# EAGLE design board1 (EAGLE 8.3.2)
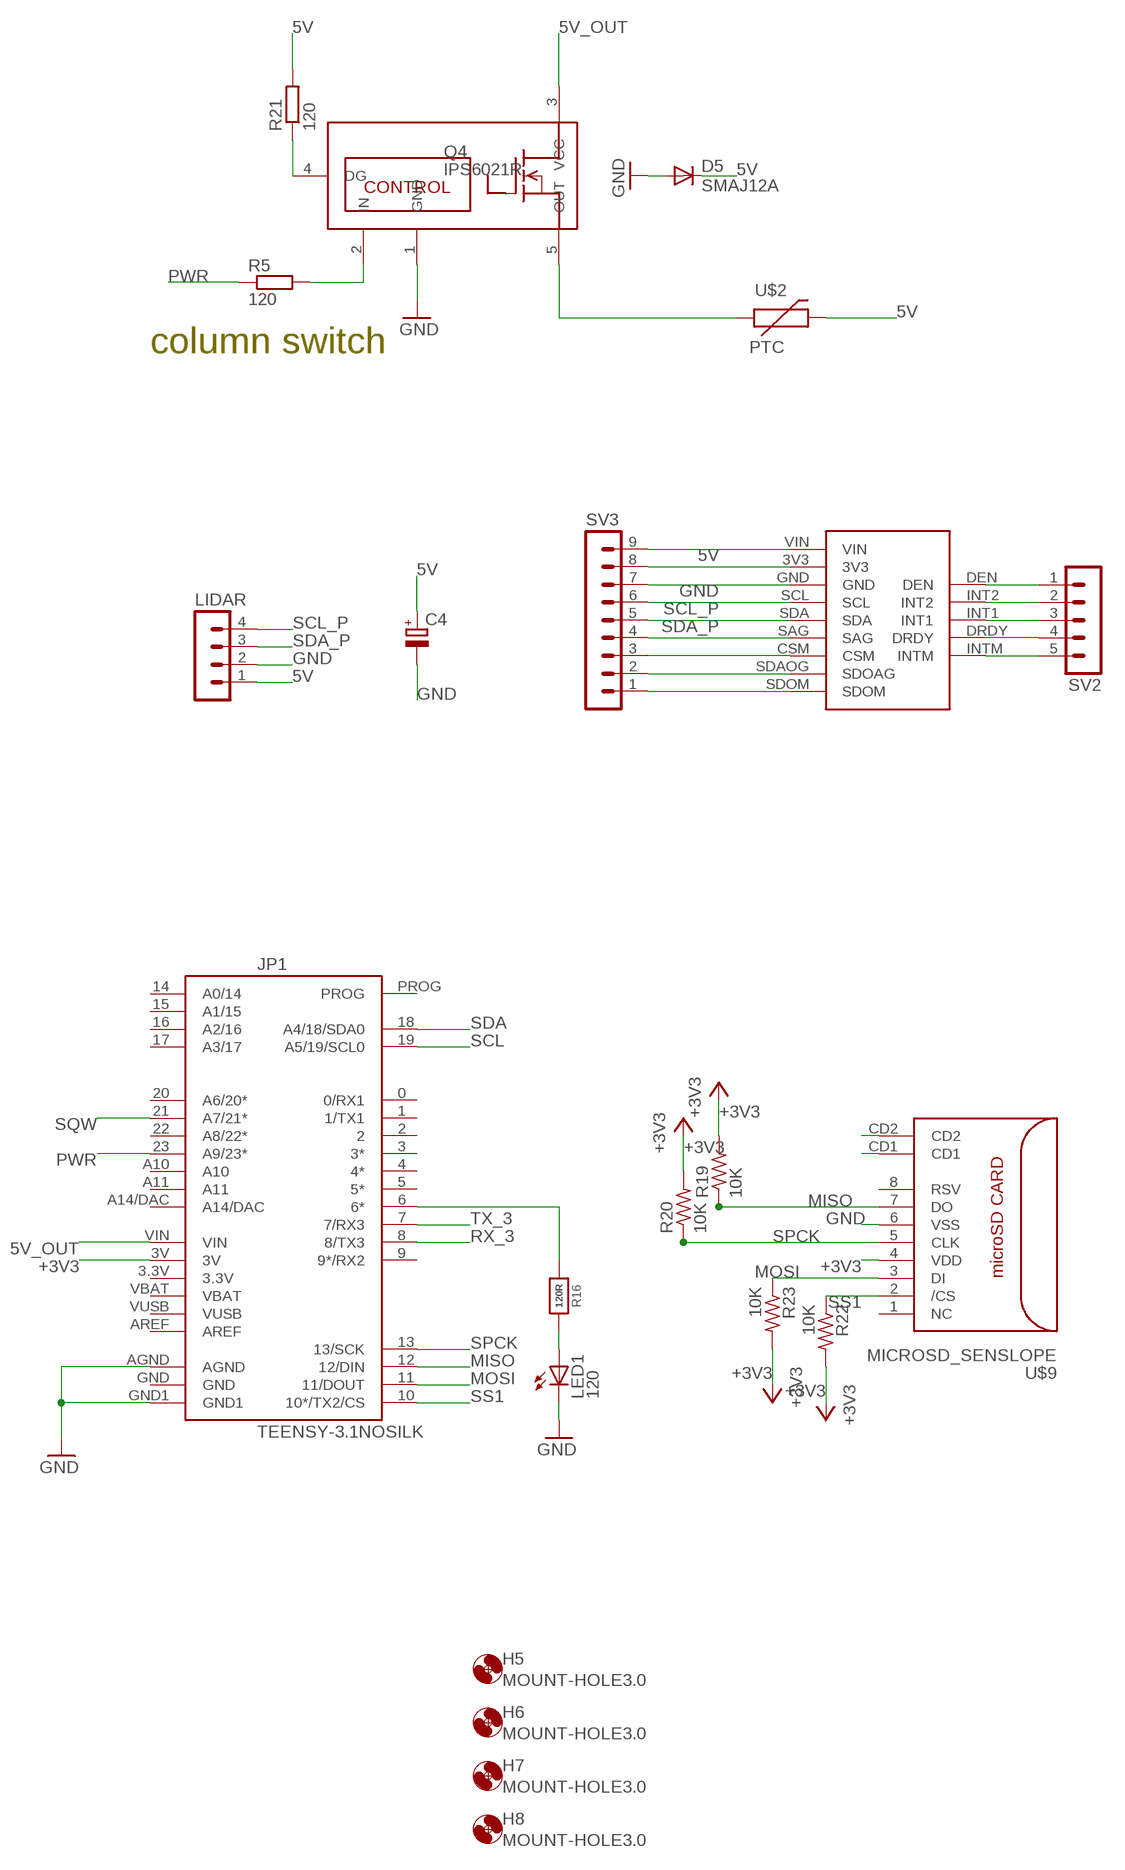
[diagram p0: schematic, sheet 1, part 1 of 2]
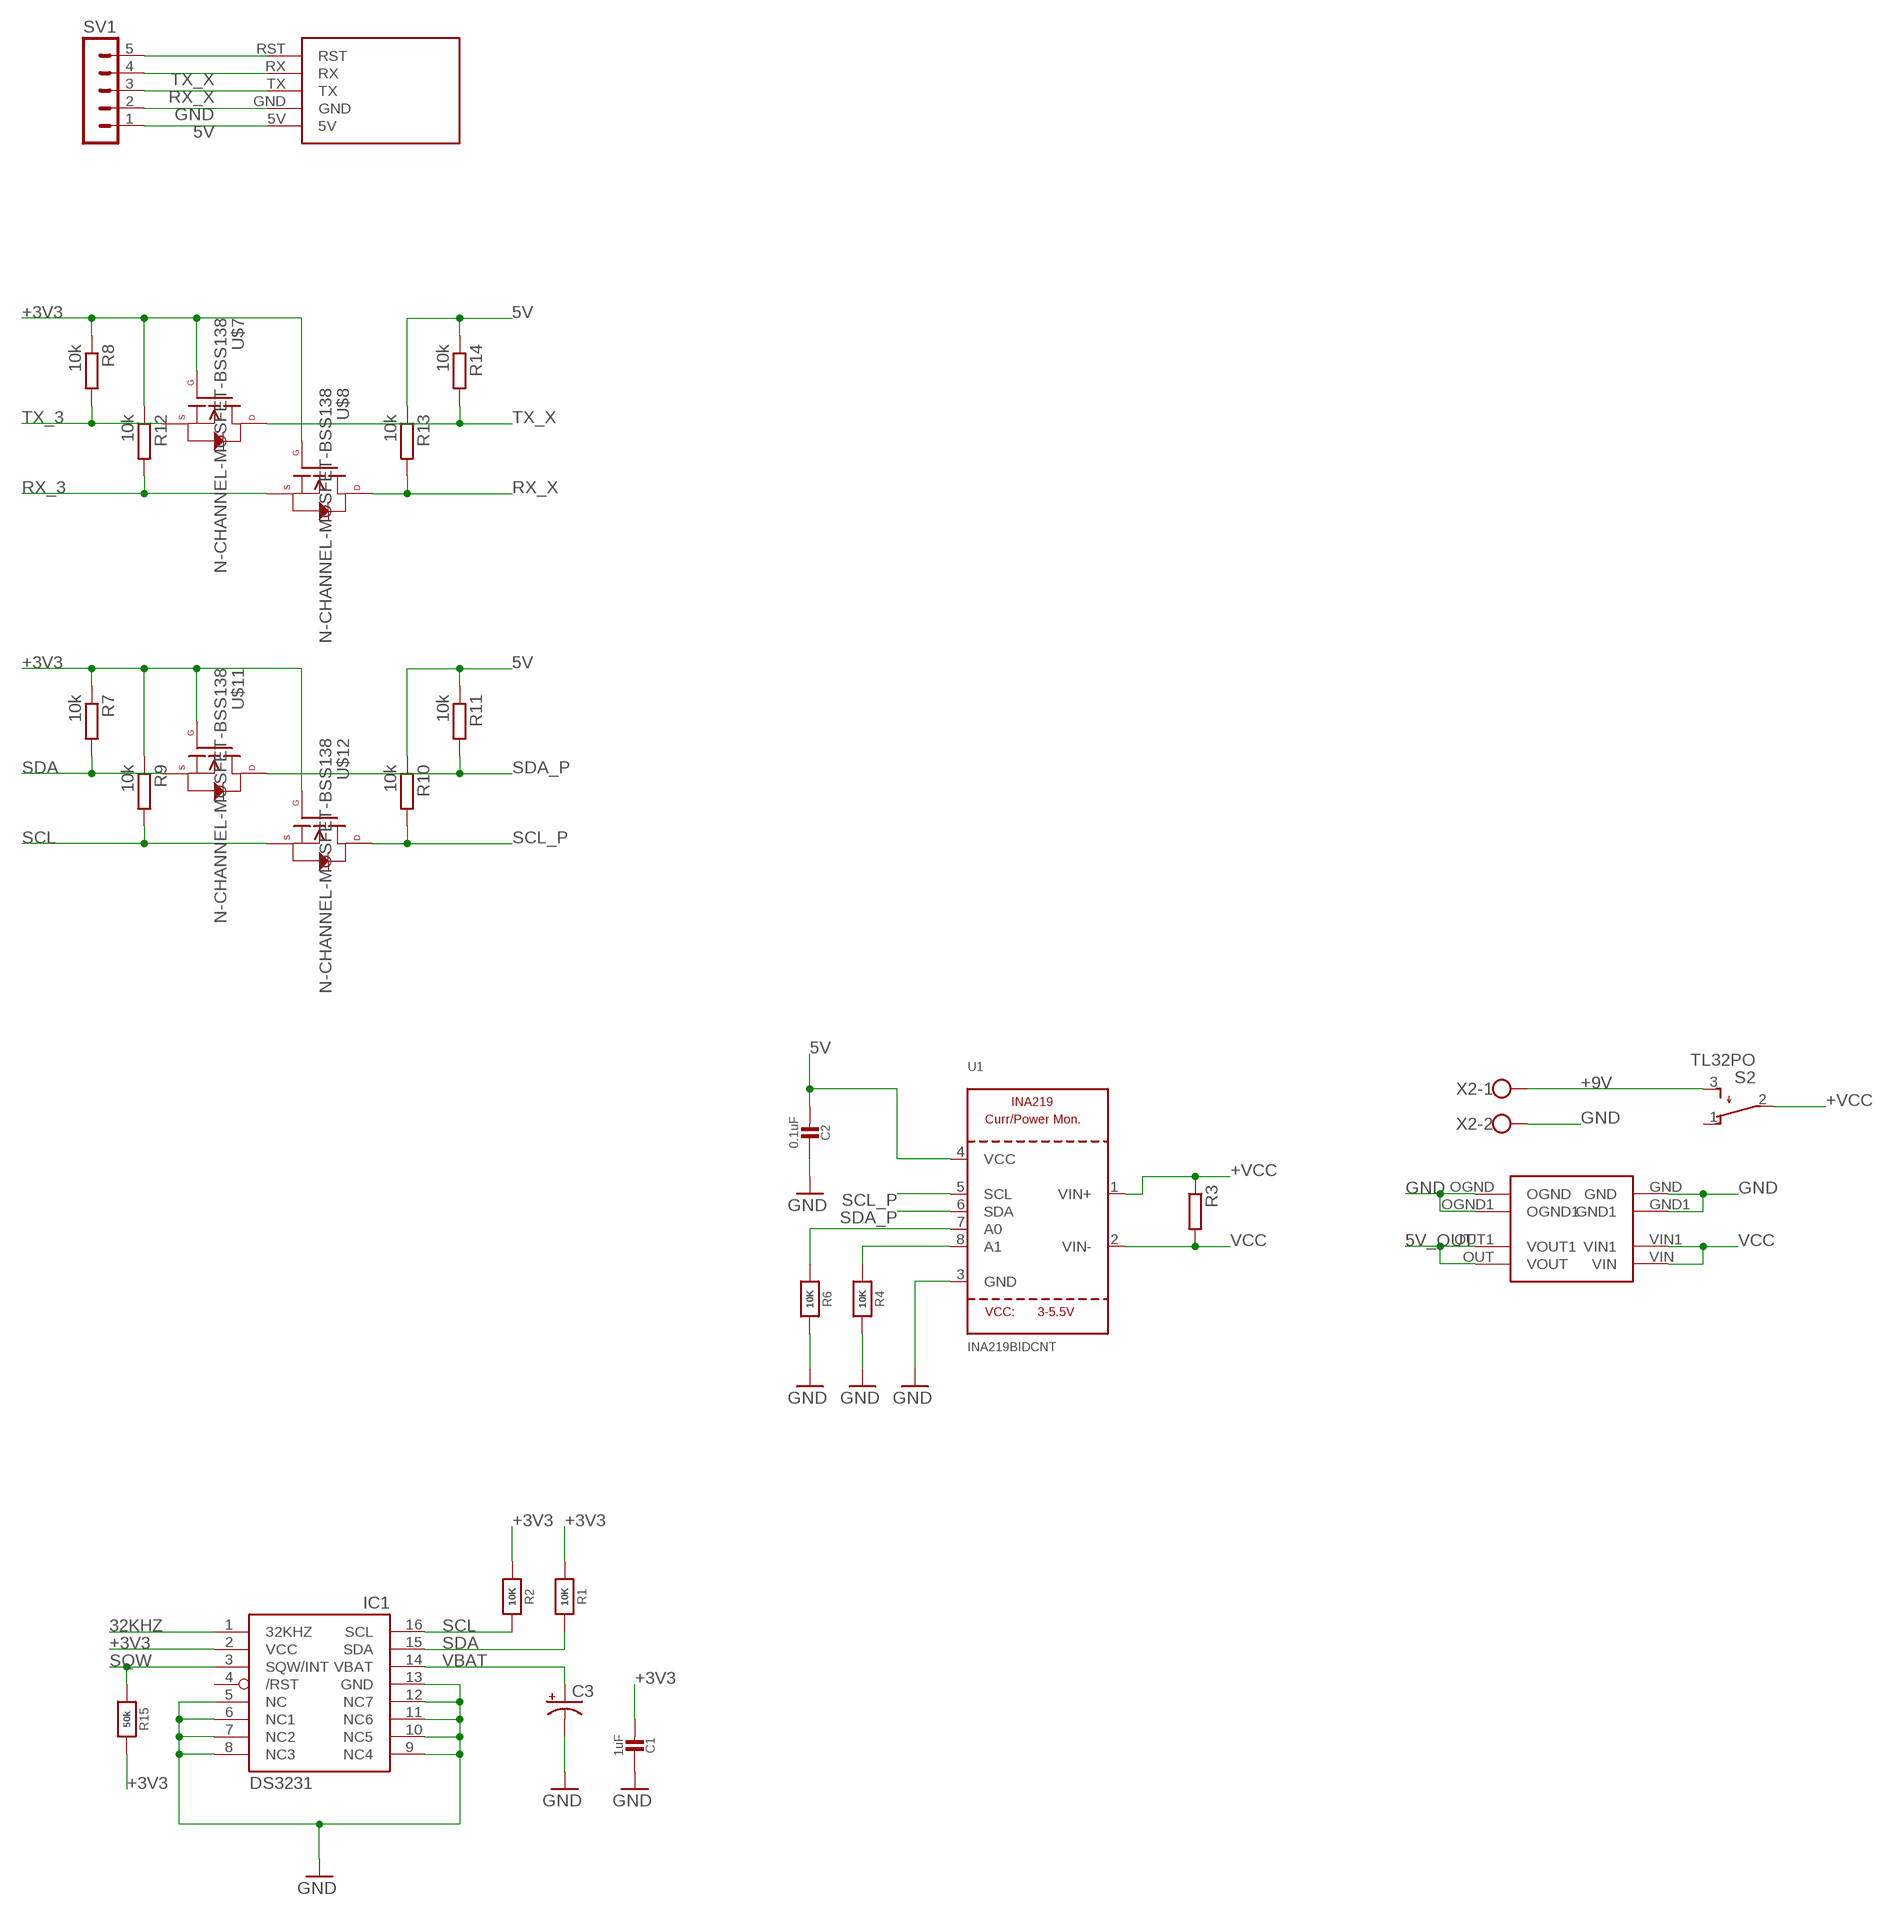
[diagram p1: schematic, sheet 1, part 2 of 2]

## Parts
C1  1uF  CAP_CERAMIC0805-NOOUTLINE  [0805-NO]
C2  0.1uF  CAP_CERAMIC0805-NOOUTLINE  [0805-NO]
C3  CAP_POL7343  [EIA7343]
C4  CPOL-EUG  [PANASONIC_G]
D5  SMAJ12A  DIODE-DO214AC  [DO214AC]
H5  MOUNT-HOLE3.0  [3,0]
H6  MOUNT-HOLE3.0  [3,0]
H7  MOUNT-HOLE3.0  [3,0]
H8  MOUNT-HOLE3.0  [3,0]
IC1  DS3231/SO  [SO16W]
JP1  TEENSY-3.1NOSILK  [TEENSY-3.1_NOSILK]
LED1  120  LEDCHIPLED_1206  [CHIPLED_1206]
LIDAR  MA04-1  [MA04-1]
Q4  IPS6021R  [DPAK-5LEAD]
R1  10K  RESISTOR0805_NOOUTLINE  [0805-NO]
R2  10K  RESISTOR0805_NOOUTLINE  [0805-NO]
R3  RR2512  [R2512]
R4  10K  RESISTOR0805_NOOUTLINE  [0805-NO]
R5  120  R-EU_R0603  [R0603]
R6  10K  RESISTOR0805_NOOUTLINE  [0805-NO]
R7  10k  RR0603  [R0603]
R8  10k  RR0603  [R0603]
R9  10k  RR0603  [R0603]
R10  10k  RR0603  [R0603]
R11  10k  RR0603  [R0603]
R12  10k  RR0603  [R0603]
R13  10k  RR0603  [R0603]
R14  10k  RR0603  [R0603]
R15  50k  RESISTOR0805_NOOUTLINE  [0805-NO]
R16  120R  RESISTOR0805_NOOUTLINE  [0805-NO]
R19  10K  R-US_R0603  [R0603]
R20  10K  R-US_R0603  [R0603]
R21  120  R-EU_R0603  [R0603]
R22  10K  R-US_R0603  [R0603]
R23  10K  R-US_R0603  [R0603]
S2  TL32PO  [TL3XPO]
SV1  MA05-1  [MA05-1]
SV2  MA05-1  [MA05-1]
SV3  MA09-1  [MA09-1]
U1  INA219BIDCNT  INA219  [SOT23-8]
U$1  LSM9DS1  [9DOF]
U$2  PTC  [MC331XX]
U$3  DC-DC  [DC-DC]
U$7  N-CHANNEL-MOSFET-BSS138  [SOT23-3]
U$8  N-CHANNEL-MOSFET-BSS138  [SOT23-3]
U$9  MICROSD_SENSLOPE  [SENSLOPESD]
U$11  N-CHANNEL-MOSFET-BSS138  [SOT23-3]
U$12  N-CHANNEL-MOSFET-BSS138  [SOT23-3]
X2  W237-102  [W237-102]
XBEE  XBEE-SHIELD  [XBEE-SHIELD]

## Nets
5V: C2.2 C4.+ D5.C LIDAR.1 R10.1 R11.1 R13.1 R14.1 R21.2 SV1.1 SV3.9 U1.4(VCC) U$1.VIN U$2.P$2 XBEE.5V
5V_OUT: JP1.VIN Q4.3(VCC) U$3.OUT1(VOUT1) U$3.OUT(VOUT)
32KHZ: IC1.1(32KHZ)
+3V3: C1.2 IC1.2(VCC) JP1.3V R1.1 R2.1 R7.1 R8.1 R9.1 R12.1 R15.2 R19.2 R20.2 R22.2 R23.2 U$7.1(G) U$8.1(G) U$9.4(VDD) U$11.1(G) U$12.1(G)
+9V: S2.3(S) X2.1
+VCC: R3.1 S2.2(P) U1.1(VIN+)
CD: U$9.CD1
GND: C1.1 C2.1 C3.C(-) C4.- D5.A IC1.5(NC) IC1.6(NC1) IC1.7(NC2) IC1.8(NC3) IC1.9(NC4) IC1.10(NC5) IC1.11(NC6) IC1.12(NC7) IC1.13(GND) JP1.AGND JP1.GND1 LED1.C LIDAR.2 Q4.1(GND) R4.2 R6.2 SV1.2 SV3.7 U1.3(GND) U$1.GND U$3.GND U$3.GND1 U$3.OGND U$3.OGND1 U$9.6(VSS) X2.2 XBEE.GND
MISO: JP1.12(12/DIN) R19.1 U$9.7(DO)
MOSI: JP1.11(11/DOUT) R23.1 U$9.3(DI)
N$1: R4.1 U1.8(A1)
N$2: R6.1 U1.7(A0)
N$3: JP1.6(6*) R16.1
N$4: Q4.4(DG) R21.1
N$5: U$9.CD2
N$6: LED1.A R16.2
N$8: SV3.8 U$1.3V3
N$11: Q4.2(IN) R5.2
N$12: SV3.4 U$1.SAG
N$13: SV3.3 U$1.CSM
N$14: SV3.2 U$1.SDAOG(SDOAG)
N$15: Q4.5(OUT) U$2.P$1
N$16: SV3.1 U$1.SDOM
N$17: SV2.1 U$1.DEN
N$18: SV2.2 U$1.INT2
N$19: SV2.3 U$1.INT1
N$20: SV2.4 U$1.DRDY
N$21: SV2.5 U$1.INTM
N$22: SV1.5 XBEE.RST
PWR: JP1.23(A9/23*) R5.1
RX_3: JP1.8(8/TX3) R12.2 U$8.2(S)
RX_X: R13.2 SV1.3 U$8.3(D) XBEE.TX
SCL: IC1.16(SCL) JP1.19(A5/19/SCL0) R2.2 R9.2 U$12.2(S)
SCL_P: LIDAR.4 R10.2 SV3.6 U1.5(SCL) U$1.SCL U$12.3(D)
SDA: IC1.15(SDA) JP1.18(A4/18/SDA0) R1.2 R7.2 U$11.2(S)
SDA_P: LIDAR.3 R11.2 SV3.5 U1.6(SDA) U$1.SDA U$11.3(D)
SPCK: JP1.13(13/SCK) R20.1 U$9.5(CLK)
SQW: IC1.3(SQW/INT) JP1.21(A7/21*) R15.1
SS1: JP1.10(10*/TX2/CS) R22.1 U$9.2(/CS)
TX_3: JP1.7(7/RX3) R8.2 U$7.2(S)
TX_X: R14.2 SV1.4 U$7.3(D) XBEE.RX
VBAT: C3.A(+) IC1.14(VBAT)
VCC: R3.2 U1.2(VIN-) U$3.VIN U$3.VIN1
Unconnected: IC1.4(/RST) JP1.0(0/RX1) JP1.1(1/TX1) JP1.2 JP1.3(3*) JP1.3.3V JP1.4(4*) JP1.5(5*) JP1.9(9*/RX2) JP1.14(A0/14) JP1.15(A1/15) JP1.16(A2/16) JP1.17(A3/17) JP1.20(A6/20*) JP1.22(A8/22*) JP1.A10 JP1.A11 JP1.A14/DAC JP1.AREF JP1.GND JP1.PROG JP1.VBAT JP1.VUSB S2.1(O) U$9.1(NC) U$9.8(RSV)

## Notes on the sheet
- column switch

## Library data of the parts
C1 C2 = microbuilder:CAP_CERAMIC: Ceramic Capacitors For new designs, use the packages preceded by an '_' character since they are more reliable: The following footprints should be used on most boards: _0402 - Standard footprint for regular board layouts _0603 - Standard footprint for regular board layouts _0805 - Standard footprint for regular board layouts _1206 - Standard footprint for regular board layouts For extremely tight-pitch boards where space is at a premium, the following 'micro-pitch' footprints can be used (smaller pads, no silkscreen outline, etc.): _0402MP - Micro-pitch footprint for very dense/compact boards _0603MP - Micro-pitch footprint for very dense/compact boards _0805MP - Micro-pitch footprint for very dense/compact boards _1206MP - Micro-pitch footprint for very dense/compact boards
C3 = SparkFun-Passives:CAP_POL: Capacitor Polarized These are standard SMD and PTH capacitors. Normally 10uF, 47uF, and 100uF in electrolytic and tantalum varieties. Always verify the external diameter of the through hole cap, it varies with capacity, voltage, and manufacturer. The EIA devices should be standard.
C4 = resistor:CPOL-EU: POLARIZED CAPACITOR, European symbol
D5 = diode:DIODE-: DIODE
H5-H8 = holes:MOUNT-HOLE: MOUNTING HOLE with drill center marker
IC1 = adafruit:DS3231
JP1 = Testing:TEENSY-3.1
LED1 = adafruit:LED: LED OSRAM: - CHIPLED LG R971, LG N971, LY N971, LG Q971, LY Q971, LO R971, LY R971 LH N974, LH R974 LS Q976, LO Q976, LY Q976 LO Q996 - Hyper CHIPLED LW Q18S LB Q993, LB Q99A, LB R99A - SideLED LS A670, LO A670, LY A670, LG A670, LP A670 LB A673, LV A673, LT A673, LW A673 LH A674 LY A675 LS A676, LA A676, LO A676, LY A676, LW A676 LS A679, LY A679, LG A679 - Hyper Micro SIDELED® LS Y876, LA Y876, LO Y876, LY Y876 LT Y87S - SmartLED LW L88C, LW L88S LB L89C, LB L89S, LG L890 LS L89K, LO L89K, LY L89K LS L896, LA L896, LO L896, LY L896 - TOPLED LS T670, LO T670, LY T670, LG T670, LP T670 LSG T670, LSP T670, LSY T670, LOP T670, LYG T670 LG T671, LOG T671, LSG T671 LB T673, LV T673, LT T673, LW T673 LH T674 LS T676, LA T676, LO T676, LY T676, LB T676, LH T676, LSB T676, LW T676 LB T67C, LV T67C, LT T67C, LS T67K, LO T67K, LY T67K, LW E67C LS E67B, LA E67B, LO E67B, LY E67B, LB E67C, LV E67C, LT E67C LW T67C LS T679, LY T679, LG T679 LS T770, LO T770, LY T770, LG T770, LP T770 LB T773, LV T773, LT T773, LW T773 LH T774 LS E675, LA E675, LY E675, LS T675 LS T776, LA T776, LO T776, LY T776, LB T776 LHGB T686 LT T68C, LB T68C - Hyper Mini TOPLED® LB M676 - Mini TOPLED Santana® LG M470 LS M47K, LO M47K, LY M47K Source: http://www.osram.convergy.de/
LIDAR = con-lstb:MA04-1: PIN HEADER; OC_FARNELL: unknown; OC_NEWARK: unknown
Q4 = DRiMS-Dong:IPS6021
R1 R2 R4 R6 R15 R16 = microbuilder:RESISTOR: Resistors For new designs, use the packages preceded by an '_' character since they are more reliable: The following footprints should be used on most boards: _0402 - Standard footprint for regular board layouts _0603 - Standard footprint for regular board layouts _0805 - Standard footprint for regular board layouts _1206 - Standard footprint for regular board layouts For extremely tight-pitch boards where space is at a premium, the following 'micro-pitch' footprints can be used (smaller pads, no silkscreen outline, etc.): _0402MP - Micro-pitch footprint for very dense/compact boards _0603MP - Micro-pitch footprint for very dense/compact boards _0805MP - Micro-pitch footprint for very dense/compact boards _1206MP - Micro-pitch footprint for very dense/compact boards
R3 R7-R14 = eagle-ltspice:R: RESISTOR, European symbol; SPICEMODEL: NONE; SPICEPREFIX: R
R5 R21 = rcl:R-EU_: RESISTOR, European symbol
R19 R20 R22 R23 = rcl:R-US_: RESISTOR, American symbol
S2 = switch:TL32PO: TINY SWITCH ON - MOM Source: http://www2.produktinfo.conrad.com/datenblaetter/700000-724999/705152-da-01-de-Subminiaturschalter_TL_36YO.pdf
SV1 SV2 = con-lstb:MA05-1: PIN HEADER; OC_FARNELL: unknown; OC_NEWARK: unknown
SV3 = con-lstb:MA09-1: PIN HEADER; OC_FARNELL: unknown; OC_NEWARK: unknown
U1 = microbuilder:INA219: INA219 - I2C Current/Power Monitor Voltage Range: 0-26V Accuracy: 0.5% Temperature: -40°C - 125°C
U$1 = 9dof:LSM9DS1
U$2 = GeekAmmo:PTC: PTC Resettable Fuse
U$3 = maDc-dc:DC-DC
U$7 U$8 U$11 U$12 = GeekAmmo:N-CHANNEL-MOSFET: N-Channel MOSFET Mode Field Effect Transistor; DATASHEET: http://www.fairchildsemi.com/ds/BS/BSS138.pdf; DIGIKEY: BSS138TR-ND; ELEMENT14: 2323154; URL: http://au.element14.com/fairchild-semiconductor/bss138/mosfet-n-ch-50v-220ma-sot-23/dp/2323154
U$9 = MICROSD:MICROSD_SENSLOPE
X2 = con-wago-500:W237-102: WAGO SCREW CLAMP; MPN: 237-102; OC_FARNELL: unknown; OC_NEWARK: 70K9898
XBEE = xbee explorer:XBEE-SHIELD

## Board
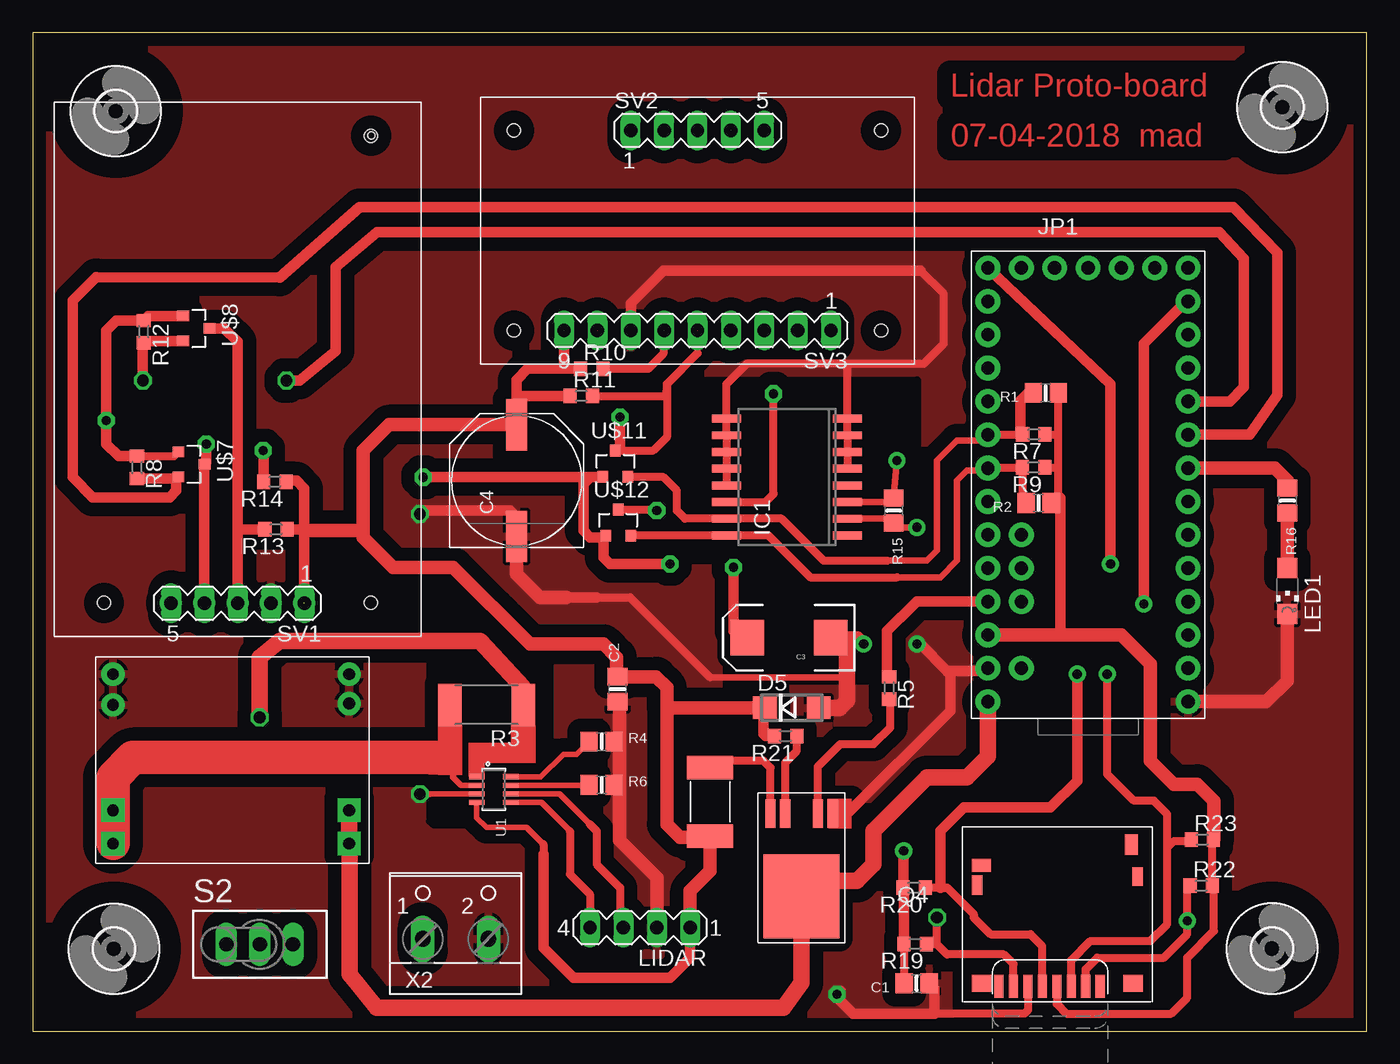
[diagram p2: board, top side]
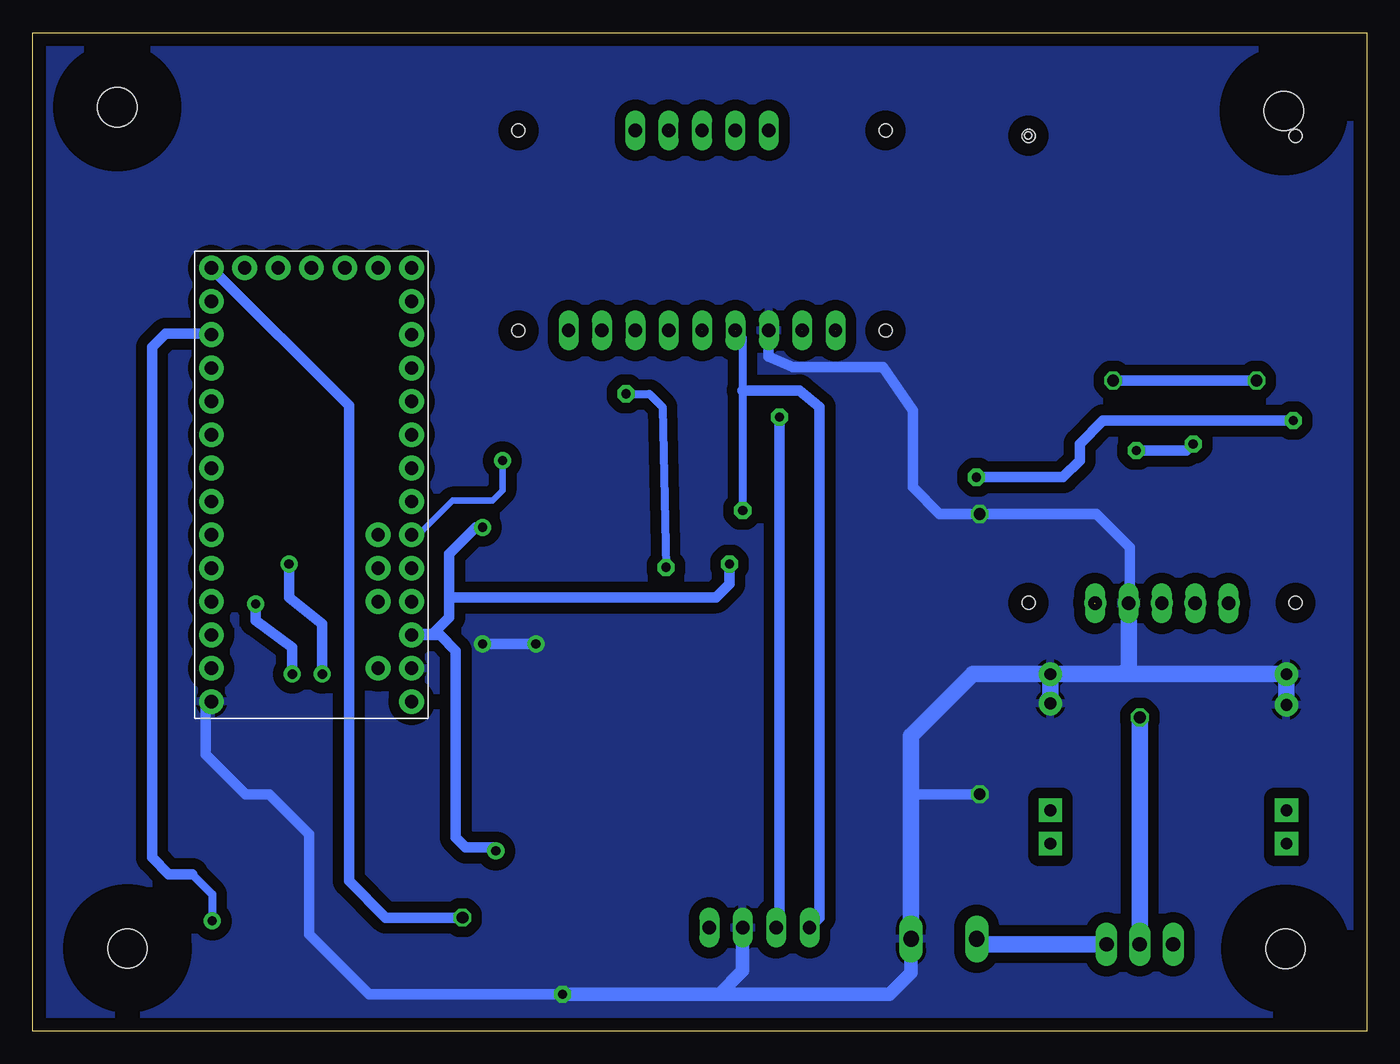
[diagram p3: board, bottom side, seen from below]

Size 101.54 x 76 mm. Coordinates in mm from the lower left corner, seen from the top.
Outline: 0,0 101.54,0 101.54,76 0,76 0,0
Copper layers (1*16): Top 0.035mm / dielectric 1.5mm / Bottom 0.035mm
Design rules "default": minimum track width 6mil, minimum drill 0.35mm, track to track 6mil, track to pad 6mil, pad to pad 6mil, via to via 6mil, smd to smd 6mil, copper to edge 40mil, drill to drill 6mil, minimum pad ring 10mil, minimum via ring 8mil, stop-mask expansion 4mil, vias tented up to drill 0mil, thermal gap 10mil
Holes 0.55 mm at 25.76,68.17

### Footprints (pad centres in the part's own frame; a part is rotated, then mirrored left to right if it is on the bottom)
0805-NO = smd 1.3 x 1.5: 1 -0.95,0; 2 0.95,0
EIA7343 = smd 2.55 x 2.7: A 3.17,0; C -3.17,0
PANASONIC_G = smd 3.9 x 1.6: + 4.25,0; - -4.25,0
DO214AC = smd 1.8 x 1.7: A 2.05,0; C -2.05,0
3,0 = hole 3: 0,0
SO16W = smd 0.6 x 2.2: 1 -4.445,-4.6; 2 -3.175,-4.6; 3 -1.905,-4.6; 4 -0.635,-4.6; 5 0.635,-4.6; 6 1.905,-4.6; 7 3.175,-4.6; 8 4.445,-4.6; 9 4.445,4.6; 10 3.175,4.6; 11 1.905,4.6; 12 0.635,4.6; 13 -0.635,4.6; 14 -1.905,4.6; 15 -3.175,4.6; 16 -4.445,4.6
TEENSY-3.1_NOSILK = drill 1.016 pad 1.88: 0 16.51,3.81; 1 16.51,6.35; 2 16.51,8.89; 3 16.51,11.43; 3.3V 11.43,34.29; 3V 1.27,6.35; 4 16.51,13.97; 5 16.51,16.51; 6 16.51,19.05; 7 16.51,21.59; 8 16.51,24.13; 9 16.51,26.67; 10 16.51,29.21; 11 16.51,31.75; 12 16.51,34.29; 13 1.27,34.29; 14 1.27,31.75; 15 1.27,29.21; 16 1.27,26.67; 17 1.27,24.13; 18 1.27,21.59; 19 1.27,19.05; 20 1.27,16.51; 21 1.27,13.97; 22 1.27,11.43; 23 1.27,8.89; A10 3.81,11.43; A11 3.81,13.97; A14/DAC 3.81,34.29; AGND 1.27,3.81; AREF 3.81,8.89; GND 8.89,34.29; GND1 16.51,1.27; PROG 6.35,34.29; VBAT 13.97,34.29; VIN 1.27,1.27; VUSB 3.81,3.81
CHIPLED_1206 = smd 1.5 x 1.5: A 0,-1.75; C 0,1.75
MA04-1 = drill 1.016 long: 1 -3.81,0; 2 -1.27,0; 3 1.27,0; 4 3.81,0
DPAK-5LEAD = smd 0.787 x 2.184: 1 -2.362,-2.489; 2 -1.245,-2.489; 4 1.245,-2.489; 5 2.362,-2.489 | smd 5.791 x 6.401: 3 0,3.81
R2512 = smd 1.8 x 3.2: 1 -2.8,0; 2 2.8,0
R0603 = smd 1 x 1.1: 1 -0.85,0; 2 0.85,0
TL3XPO = drill 1.1 pad 1.422 long: 1 -2.54,0; 2 0,0; 3 2.54,0
MA05-1 = drill 1.016 long: 1 -5.08,0; 2 -2.54,0; 3 0,0; 4 2.54,0; 5 5.08,0
MA09-1 = drill 1.016 long: 1 -10.16,0; 2 -7.62,0; 3 -5.08,0; 4 -2.54,0; 5 0,0; 6 2.54,0; 7 5.08,0; 8 7.62,0; 9 10.16,0
SOT23-8 = smd 0.4 x 1.2: 1 -0.975,-1.3; 2 -0.325,-1.3; 3 0.325,-1.3; 4 0.975,-1.3; 5 0.975,1.3; 6 0.325,1.3; 7 -0.325,1.3; 8 -0.975,1.3
9DOF = drill 0.75 pad 1.422: 3V3 -6.35,-1.27; CSM 6.35,-1.27; DEN -3.81,13.97; DRDY 3.81,13.97; GND -3.81,-1.27; INT1 1.27,13.97; INT2 -1.27,13.97; INTM 6.35,13.97; SAG 3.81,-1.27; SCL -1.27,-1.27; SDA 1.27,-1.27; SDAOG 8.89,-1.27; SDOM 11.43,-1.27; VIN -8.89,-1.27 | hole 1: 15.24,-1.27; -12.7,-1.27; 15.24,13.97; -12.7,13.97
MC331XX = smd 1.78 x 3.5: P$1 0,0; P$2 5.23,0
DC-DC = drill 0.9 pad 1.778: GND 7.82,10.36; GND1 5.48,10.36; OGND 7.82,-7.62; OGND1 5.58,-7.62 | drill 0.9 pad 1.778 square: OUT -5.08,-7.62; OUT1 -2.54,-7.62; VIN -5.08,10.36; VIN1 -2.54,10.36
SOT23-3 = smd 0.8 x 0.9: 1 -0.95,-1; 2 0.95,-1; 3 0,1
SENSLOPESD = smd 0.7 x 1.74: 1 3.5,-4.66; 2 2.4,-4.66; 3 1.3,-4.66; 4 0.2,-4.66; 5 -0.9,-4.66; 6 -2,-4.66; 7 -3.1,-4.66; 8 -4.2,-4.66 | smd 1.45 x 1: CD1 -5.525,4.54 | smd 1 x 1.55: CD2 5.869,6.115 | smd 1.5 x 1.3: P$9 -5.5,-4.435; P$10 6,-4.435 | smd 0.8 x 1.5: P$11 -5.85,3.04 | smd 0.8 x 1.4: P$14 6.35,3.69
W237-102 = drill 1.194 long: 1 -2.5,-1.27; 2 2.5,-1.27
XBEE-SHIELD = drill 1 pad 1.676: 5V 5.08,-7.62; GND 2.54,-7.62; RST -5.08,-7.62; RX -2.54,-7.62; TX 0,-7.62 | hole 1: 10.16,-7.62; -10.16,-7.62; 10.16,27.94; -10.16,27.94

### Placement (x,y rotation side)
C1  67.28,3.63 180 top
C2  44.51,26.03 90 top
C3  57.55,29.95 180 top
C4  36.83,41.91 90 top
D5  57.78,24.61 0 top
H5  94.33,6.28 0 top
H6  95.12,70.33 0 top
H7  6.32,70.04 0 top
H8  6.17,6.27 0 top
IC1  57.4,42.18 90 top
JP1  71.44,23.81 0 top
LED1  95.5,33.5 180 top
LIDAR  46.23,7.87 180 top
Q4  58.52,14.07 180 top
R1  77.11,48.59 180 top
R2  76.57,40.2 180 top
R3  34.54,24.84 180 top
R4  43.3,22.04 0 top
R5  65.19,26.11 270 top
R6  43.3,18.74 0 top
R7  76.2,45.43 180 top
R8  7.93,42.92 270 top
R9  76.19,42.91 180 top
R10  42.54,50.42 0 top
R11  41.76,48.35 0 top
R12  8.44,53.25 270 top
R13  18.52,38.2 180 top
R14  18.42,41.82 180 top
R15  65.53,39.62 270 top
R16  95.5,40.39 270 top
R19  67.17,6.64 180 top
R20  67.09,10.91 180 top
R21  57.31,22.46 180 top
R22  88.95,11.06 0 top
R23  89.03,14.57 0 top
S2  17.27,6.6 0 top
SV1  15.6,32.56 180 top
SV2  50.6,68.58 0 top
SV3  50.6,53.34 180 top
U1  35.09,18.39 270 top
U$1  49.33,54.6 0 top
U$2  51.56,20.07 270 top
U$3  16.46,19.35 90 top
U$7  12.08,43.16 270 top
U$8  12.44,53.49 270 top
U$9  77.75,8.07 0 top
U$11  44.35,43.2 0 top
U$12  44.56,38.71 0 top
X2  32.18,8.29 0 top
XBEE  15.58,40.22 0 top

### Tracks (layer width: path | path; a pad name or v marks a point on that pad's centre or on a via)
5V  (2 unrouted)
  Top 0.406: U1.4 33.79,16.25 34.54,15.49 37.59,15.49 38.61,14.48
  Top 0.508: 38.61,14.48 38.86,14.22
  Top 0.61: 38.86,14.22 38.86,13.46
  Top 0.813: R14.1 19.36,41.91 20.07,41.91 20.66,41.32 20.66,38.1 XBEE.5V | 20.56,38.2 R13.1 | C4.+ 36.83,48.67 | 40.39,52.07 40.39,53.24 40.44,53.29 U$1.VIN 40.44,50.47 40.49,50.42 | R21.2 55.77,22.46 55.63,22.61 55.63,24.5 D5.C | 38.86,13.46 38.86,6.35 41.15,4.06 48.51,4.06 50.04,5.59 LIDAR.1 | R11.1 37.04,48.35 36.83,48.67 | 36.83,48.67 36.83,49.58 37.67,50.42 40.49,50.42 | 40.49,50.42 R10.1
  Top 1.016: LIDAR.1 50.04,10.67 51.56,12.19 U$2.P$2 51.46,14.73 49.28,14.73 48.26,15.75 48.26,24.64 | D5.C 48.29,24.61 48.26,24.64 | 48.26,24.64 48.26,26.16 47.44,26.98 C2.2 44.45,27.04 44.45,28.45 43.43,29.46 37.85,29.46 32,35.31 27.43,35.31 25.15,37.59 25.15,38.1 | C4.+ 27.11,46.16 25.15,44.2 25.15,38.1 | 25.15,38.1 20.66,38.1 20.56,38.2
5V_OUT
  Top 1.27: JP1.VIN 72.71,20.89 71.12,19.3 68.07,19.3 64.01,15.24 64.01,12.7 62.74,11.43 58.17,11.43 58.17,10.62 Q4.3 58.52,3.66 57.15,1.78 26.16,1.78 24.13,4.32 24.13,14.23 U$3.OUT U$3.OUT1
+3V3  (via drill 0.7 pad 1.3)
  Top 0.508: IC1.2 65.45,39.01 R15.2 66.11,38.35 v67.31,38.35
  Top 0.61: R23.2 89.8,14.49 R22.2 89.92,10.95 89.92,7.62 87.88,5.59 87.88,2.54 86.67,1.32 78.69,1.32 77.95,2.06 U$9.4 | 78.06,45.47 R1.1 | 78.06,42.93 78.06,45.47 | 78.06,42.93 78.06,40.74 R2.1 | R7.1 78.03,45.43 78.06,45.47 | R9.1 78.04,42.91 78.06,42.93 | R19.2 66.32,3.65 C1.2 | R8.1 10.74,43.77 U$7.1 | U$11.1 42.93,42.2
  Top 0.813: R19.2 66.32,10.83 R20.2 66.29,10.97 v66.29,13.72 | 72.52,29.97 JP1.3V | 77.05,42.93 R9.1 | 78.49,30.16 78.23,30.41 78.23,40.57 78.06,40.74 | R8.1 6.53,43.77 5.59,44.7 v5.59,46.48 5.59,53.34 6.35,54.1 R12.1 8.78,54.44 U$8.1 | v48.51,35.56 43.94,35.56 43.43,36.07 43.43,37.53 | 43.43,37.53 U$12.1 | 42.93,42.2 42.45,42.2 | 42.45,42.2 41.91,41.66 41.91,38.1 42.42,37.59 43.37,37.59 43.43,37.53 | 42.45,42.2 29.75,42.2 v29.72,42.16
  Top 1.016: JP1.3V 78.49,30.16 82.87,30.16 85.09,27.94 85.09,20.57 86.87,18.8 88.65,18.8 89.92,17.53 89.92,14.61 R23.2
  Bottom 0.508: 67.82,38.35 v67.31,38.35
  Bottom 0.813: 67.82,38.35 69.85,36.32 69.85,33.02 | 69.85,33.02 69.85,31.5 71.12,30.23 72.64,30.23 JP1.3V 70.55,30.16 69.34,28.96 69.34,14.73 68.58,13.97 66.55,13.97 v66.29,13.72 | 69.85,33.02 49.53,33.02 48.51,34.04 v48.51,35.56 | v29.72,42.16 23.11,42.16 21.84,43.43 21.84,44.7 20.07,46.48 v5.59,46.48
+9V
  Bottom 1.27: S2.3 29.27,6.6 X2.1
+VCC  (via drill 0.9 pad 1.2)
  Top 0.406: 37.34,24.38 R3.1 37.34,23.62 | 37.34,22.87 37.34,21.55 37.24,21.44 34.49,21.44 33.79,20.74 U1.1
  Top 1.016: 37.34,23.62 37.34,22.87
  Top 1.27: v17.27,23.88 17.27,28.45 18.8,29.72 34.04,29.72 37.34,26.16 37.34,24.38
  Bottom 1.27: S2.2 v17.27,23.88
GND  (via drill 0.7 pad 1.3, 0.9 pad 1.2)
  Top 0.406: 69.09,1.32 62.69,1.32 v61.21,2.79 | U1.3 30.25,18.06 30.23,18.03 v29.46,18.03
  Top 0.508: 51.56,26.92 61.47,26.92 61.98,27.43
  Top 0.61: U$9.6 75.75,1.58 75.49,1.32 69.09,1.32 68.63,1.32 | IC1.13 IC1.12 IC1.11 IC1.10 IC1.9 52.8,49.24 54.36,50.8 61.98,50.8 | IC1.5 IC1.6 IC1.7 IC1.8 62,50.78 61.98,50.8 | 51.56,26.92 45.47,33.02 42.93,33.02 | 61.98,50.8 67.82,50.8 69.34,52.32 69.34,56.13 67.56,57.91
  Top 0.813: C1.1 68.63,3.23 68.63,1.32 62.43,1.32 61.21,2.54 v61.21,2.79 61.47,3.05 | v67.31,29.46 67.56,29.46 69.6,27.43 | 69.6,27.43 72.52,27.43 JP1.AGND | Q4.1 62.02,16.56 69.85,24.38 69.85,27.18 69.6,27.43 | 40.64,33.02 42.93,33.02 | C4.- 36.83,39.12 36.32,39.62 29.72,39.62 v29.46,39.37 | 67.56,57.91 48.01,57.91 45.52,55.43 U$1.GND
  Top 1.016: C3.C 61.72,29.95 62.76,29.95 v63.25,29.46 | JP1.GND1 93.91,25.08 95.5,26.67 LED1.C | 44.65,18.8 44.65,14.53 47.5,11.68 LIDAR.2 | R6.2 44.59,18.74 44.65,18.8 | 44.65,22.1 44.65,24.94 C2.1 44.5,25.09 | 44.65,22.1 44.65,18.8 | R4.2 44.59,22.04 44.65,22.1 | C4.- 36.83,34.8 38.61,33.02 40.64,33.02
  Top 1.27: D5.A 61.44,24.61 61.98,25.15 61.98,27.43 61.98,29.69 61.72,29.95
  Bottom 0.61: 45.21,53.64 U$1.GND
  Bottom 0.813: v67.31,29.46 v63.25,29.46 | v61.21,2.79 75.95,2.79 80.52,7.37 80.52,14.99 83.57,18.03 85.34,18.03 88.39,21.08 88.39,24.64 JP1.GND1 | U$1.GND 45.52,51.36 43.69,50.55 36.83,50.55 34.54,47.24 34.54,41.4 32.51,39.37 v29.46,39.37 20.57,39.37 18.03,36.83 18.03,32.69 XBEE.GND 18.12,31.19 | v29.46,18.03 34.43,18.03 34.68,17.78
  Bottom 1.016: LIDAR.2 47.5,4.57 49.28,2.79 | 49.28,2.79 v61.21,2.79 | X2.2 34.68,4.43 36.32,2.79 49.28,2.79 | 32,25.15 34.68,22.47 | 24.29,25.15 U$3.OGND1 24.08,26.92 U$3.OGND
  Bottom 1.27: 18.54,27.17 U$3.GND U$3.GND1 | 18.54,27.17 23.83,27.17 24.08,26.92 | 24.29,25.15 24.08,25.36 U$3.OGND 29.98,27.17 34.68,22.47 34.68,17.78 X2.2 | 18.12,31.19 18.12,27.6 18.54,27.17
  pour Top (isolate 1.016): 1.02,75.44 100.84,75.44 100.84,0.76 0.25,0.76 0.25,75.44
  pour Bottom (isolate 0.813): 1.02,75.44 100.84,75.44 100.84,0.76 0.25,0.76 0.25,75.44
MISO  (via drill 0.9 pad 1.2)
  Top 0.61: U$9.7 74.65,5.11 73.91,5.84 69.6,5.84 68.83,6.6 | 68.83,6.6 68.05,6.6 R19.1 | 68.83,6.6 v68.83,8.64
  Bottom 0.813: v68.83,8.64 74.68,8.64 77.47,11.43 77.47,47.62 JP1.12
MOSI  (via drill 0.7 pad 1.3)
  Top 0.61: U$9.3 79.05,5.39 80.52,6.86 85.09,6.86 86.36,8.13 86.36,13.97 | 86.36,13.97 86.87,14.48 88.09,14.48 R23.1 | 86.36,13.97 86.36,16.51 85.34,17.53 83.82,17.53 81.79,19.56 v81.79,27.18
  Top 0.813: JP1.11 87.82,55.56 84.58,52.32 v84.58,32.51
  Bottom 0.813: v81.79,27.18 81.79,29.21 84.58,31.24 v84.58,32.51
N$1
  Top 0.406: U1.8 38.67,19.36 40.39,21.08 41.39,21.08 R4.1
N$2
  Top 0.406: U1.7 42.35,18.71 R6.1
N$3
  Top 1.016: JP1.6 94.55,42.86 95.5,41.91 R16.1
N$4
  Top 0.61: Q4.4 57.28,20.45 58.17,21.34 R21.1
N$6
  Top 1.016: LED1.A R16.2
N$7
  cutout Top: 52.83,32.77 63.5,32.77 63.5,26.67 52.83,26.67
N$8  (1 unrouted)
  Top 0.813: 43.03,52.63 42.98,52.68 SV3.8 42.98,53.9 43.13,54.05
N$9
  cutout Top: 70.36,16 85.6,16 85.6,1.52 70.36,1.52
N$10
  cutout Top: 49.78,49.53 67.31,49.53 67.31,35.81 49.78,35.81
N$11
  Top 0.61: Q4.2 59.77,20.14 61.47,21.84 64.01,21.84 65.28,23.11 65.28,25.17 R5.2
N$12
  Top 0.813: SV3.4 U$1.SAG
N$13
  Top 0.813: U$1.CSM SV3.3
N$14
  Top 0.508: SV3.2 U$1.SDAOG
N$15
  Top 0.61: Q4.5 56.16,20.04 55.63,20.57 52.07,20.57 U$2.P$1
N$16
  Top 0.508: SV3.1 U$1.SDOM
N$17
  Top 1.016: U$1.DEN SV2.1
N$18
  Top 1.016: U$1.INT2 SV2.2
N$19
  Top 1.016: U$1.INT1 SV2.3
N$20  (1 unrouted)
N$21
  Top 1.016: U$1.INTM SV2.5
N$22
  Top 0.813: SV1.5 10.52,32.58 XBEE.RST
N$23
  cutout Top: 30.23,28.19 30.23,16 30.48,15.75 39.37,15.75 39.37,28.19
PWR
  Top 0.813: JP1.23 69.02,32.7 69.01,32.72 67.31,32.72 66.09,31.5 66.04,31.5 65.02,30.48 65.02,27.13 R5.1
RX_3  (via drill 0.9 pad 1.2)
  Top 0.813: JP1.8 91.12,47.94 92.2,49.02 92.2,58.83 90.32,60.81 26.21,60.81 23.06,58.17 23.06,51.77 20.32,49.53 v19.3,49.53 | 8.38,52.07 v8.38,49.53 | 8.38,52.07 8.38,52.34 R12.2 | U$8.2 8.85,52.54 8.38,52.07
  Bottom 0.813: v19.3,49.53 v8.38,49.53
RX_X
  Top 0.508: XBEE.TX 15.58,32.58 SV1.3
  Top 0.813: R13.2 15.68,38.2 15.58,38.1 | U$8.3 14.58,53.49 15.58,52.49 15.58,38.1 | 15.58,38.1 XBEE.TX
SCL
  Top 0.508: 65.79,34.54 69.09,34.54 70.36,35.81 70.36,41.91 71.12,42.67 72.42,42.67 72.66,42.91
  Top 0.61: 65.79,34.54 59.18,34.54 55.99,37.73 IC1.16 45.54,37.73 U$12.2 | 72.66,42.91 JP1.19 | 72.66,42.91 R9.2 75.34,40.49 R2.2 | 72.66,42.91 72.64,42.93
SCL_P  (via drill 0.7 pad 1.3)  (1 unrouted)
  Top 0.406: U1.5 38.72,17.41 40.89,15.24
  Top 0.508: U$1.SCL 48.06,52.07 48.01,52.02
  Top 0.61: U$12.3 47.42,39.71 v47.5,39.62 | R10.2 46.86,50.42 48.01,51.56 48.01,52.02 | 40.89,15.24 40.89,11.94 42.42,10.41 LIDAR.4
  Bottom 0.61: v47.5,39.62 47.5,48.77 47.5,52.77 U$1.SCL
  Bottom 0.813: 47.5,48.77 43.18,48.77 41.66,47.5 41.66,8.64 LIDAR.4
SDA
  Top 0.508: 65.02,35.81 68.07,35.81 68.83,36.58 68.83,43.43 70.36,44.96 72.27,44.96 72.74,45.43
  Top 0.61: 65.02,35.81 60.2,35.81 57.01,39.01 IC1.15 49.64,39.01 49.02,39.62 49.02,41.15 48.01,42.16 45.34,42.16 U$11.2 | 72.64,45.47 JP1.18 72.74,45.43 75.18,45.43 R7.2
  Top 0.813: R1.2 75.76,48.59 75.18,48.01 75.18,45.43
SDA_P  (via drill 0.7 pad 1.3)  (1 unrouted)
  Top 0.406: U1.6 40.1,18.06 42.42,15.75
  Top 0.508: U$1.SDA 50.6,51.62
  Top 0.61: U$11.3 47.25,44.2 48.26,45.21 48.26,49.28 | 50.6,51.62 48.26,49.28 | R11.2 48.25,48.35 48.26,49.28 | 42.42,15.75 42.93,15.24 42.93,12.7 44.7,10.92 44.7,8.13 LIDAR.3
  Top 0.813: v44.7,46.74 44.7,44.55 U$11.3
  Bottom 0.813: v44.7,46.74 44.7,8.13 LIDAR.3
SPCK  (via drill 0.7 pad 1.3)
  Top 0.61: U$9.5 76.85,6.46 75.95,7.37 72.9,7.37 71.63,8.64 71.63,8.89 69.61,10.91 69.09,10.91 R20.1
  Top 0.813: v79.5,27.18 79.5,19.05 77.47,17.02 70.87,17.02 69.09,15.24 69.09,10.91 | JP1.13 82.04,49.28 v82.04,35.56
  Bottom 0.813: v79.5,27.18 79.5,30.99 82.04,33.02 v82.04,35.56
SQW  (via drill 0.7 pad 1.3)
  Top 0.508: IC1.3 65.49,40.27 R15.1 v65.79,43.43
  Bottom 0.508: v65.79,43.43 65.79,41.15 66.55,40.39 69.6,40.39 71.88,38.1 72.39,38.1 JP1.21
SS1  (via drill 0.7 pad 1.3)
  Top 0.61: U$9.2 80.15,4.71 81.03,5.59 86.11,5.59 87.88,7.37 v87.88,8.38 87.88,10.85 R22.1
  Bottom 0.61: 89.41,11.94 87.88,10.41 v87.88,8.38
  Bottom 0.813: 89.41,11.94 91.19,11.94 92.46,13.21 92.46,52.07 91.44,53.09 88.02,53.09 JP1.10
TX_3
  Top 0.813: R8.2 10.94,42.07 U$7.2 10.92,42.05 10.92,41.15 10.41,40.64 4.57,40.64 3.05,42.16 3.05,55.63 4.83,57.4 18.8,57.35 24.89,62.74 91.39,62.74 94.74,59.28 94.74,48.41 92.64,45.4 JP1.7
TX_X  (via drill 0.7 pad 1.3)
  Top 0.508: XBEE.RX 13.04,32.58 SV1.4
  Top 0.813: R14.2 17.57,44.15 v17.53,44.2 | v13.21,44.7 13.21,43.29 U$7.3 13.04,43.12 XBEE.RX
  Bottom 0.813: v17.53,44.2 13.72,44.2 v13.21,44.7
VBAT  (via drill 0.7 pad 1.3)
  Top 0.61: IC1.14 55.77,40.27 56.39,40.89 v56.39,48.51
  Top 0.813: v53.34,35.31 53.34,30.48 54.1,29.72 54.27,29.72 C3.A
  Bottom 0.61: v56.39,48.51 54.61,48.51 53.59,47.5 v53.34,35.31
VCC
  Top 0.406: U1.2 32.59,18.71 32,19.3
  Top 0.508: 32,19.3 32,19.81
  Top 0.61: 31.74,20.82 32,20.56 32,19.81 30.23,19.81 29.97,20.07 30.99,20.07 31.24,20.32
  Top 1.27: R3.2 31.74,20.82 31.24,20.32 30.73,20.83
  Top 2.54: U$3.VIN U$3.VIN1 6.1,19.31 7.62,20.83 30.73,20.83
(copper drawn outside any net)
  shapes: Top area x6

### Text on the board
Top: Lidar Proto-board | 07-04-2018 mad